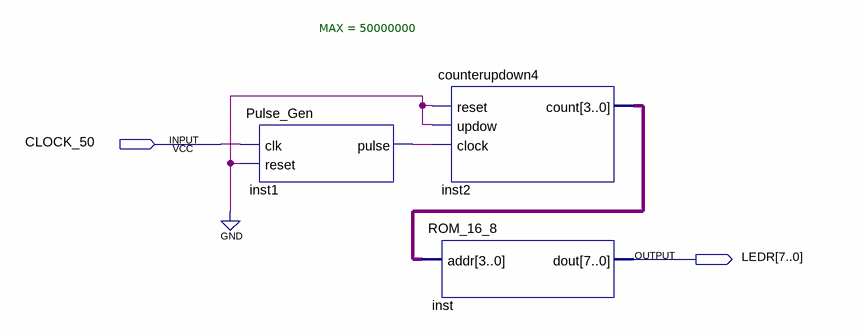
[diagram p0: schematic sheet]
// Quartus schematic ROM_Demo2.bdf as structural Verilog: 3 symbols, 2 pins
module ROM_Demo2 (
  input  CLOCK_50,
  output [7:0] LEDR
);

  wire inst1_pulse;
  wire [3:0] inst2_count;

  Pulse_Gen #(.MAX(50000000)) inst1 (.clk(CLOCK_50), .reset(1'b0), .pulse(inst1_pulse));
  ROM_16_8 inst (.addr(inst2_count), .dout(LEDR));
  counterupdown4 inst2 (.reset(1'b0), .updow(1'b0), .clock(inst1_pulse), .count(inst2_count));
endmodule
